# EAGLE schematic MySens-easyRS485-BluePill-MAPLE-V05-not-ordered-018 (EAGLE 7.6.0)
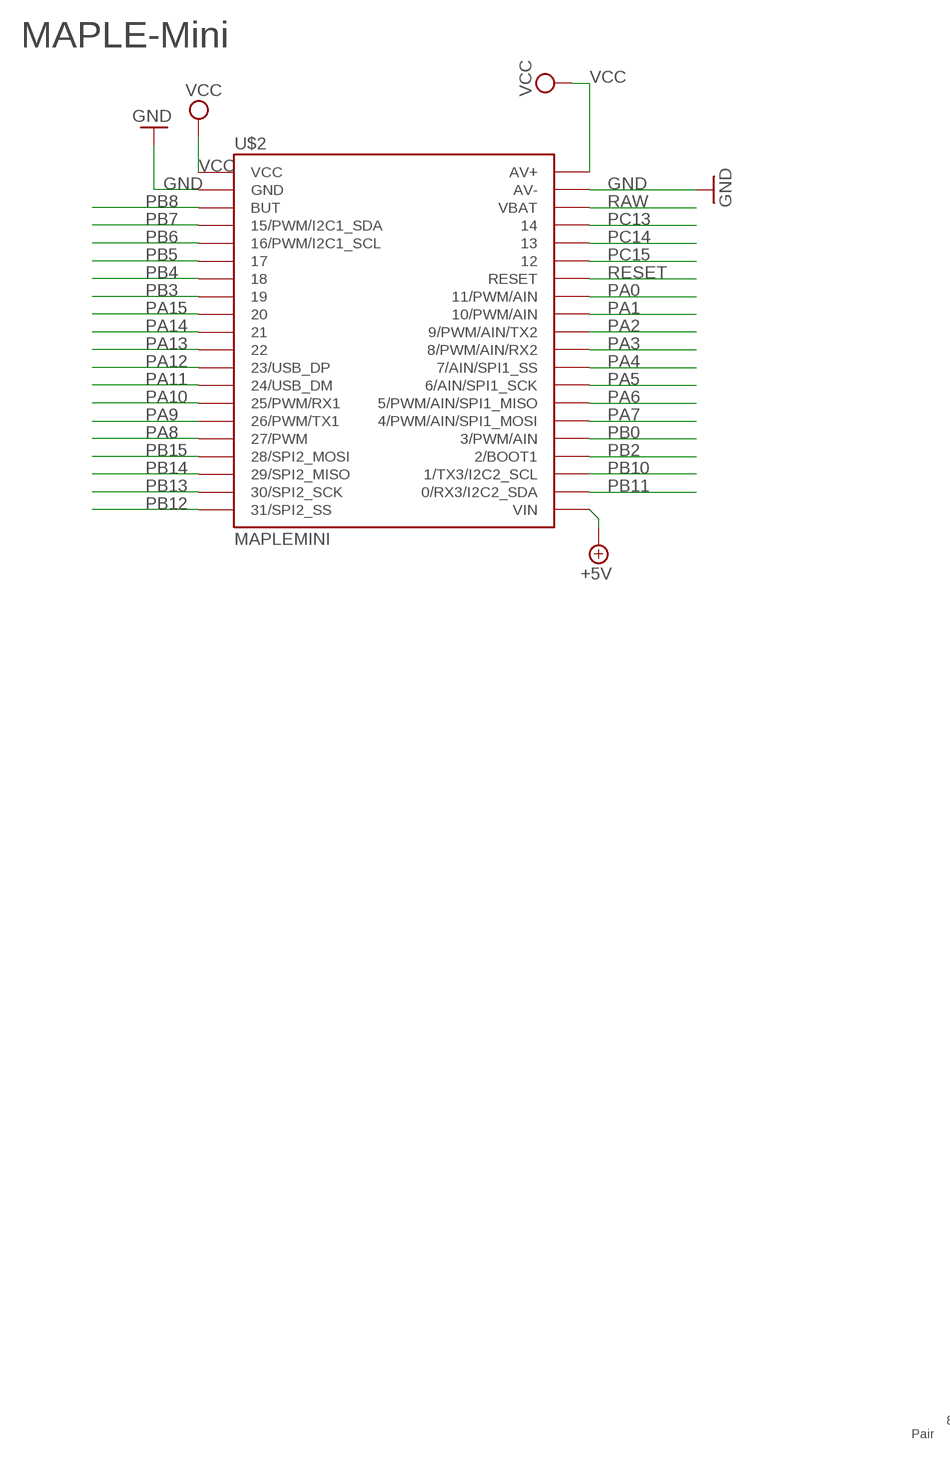
[diagram p0: schematic, sheet 1, part 1 of 2]
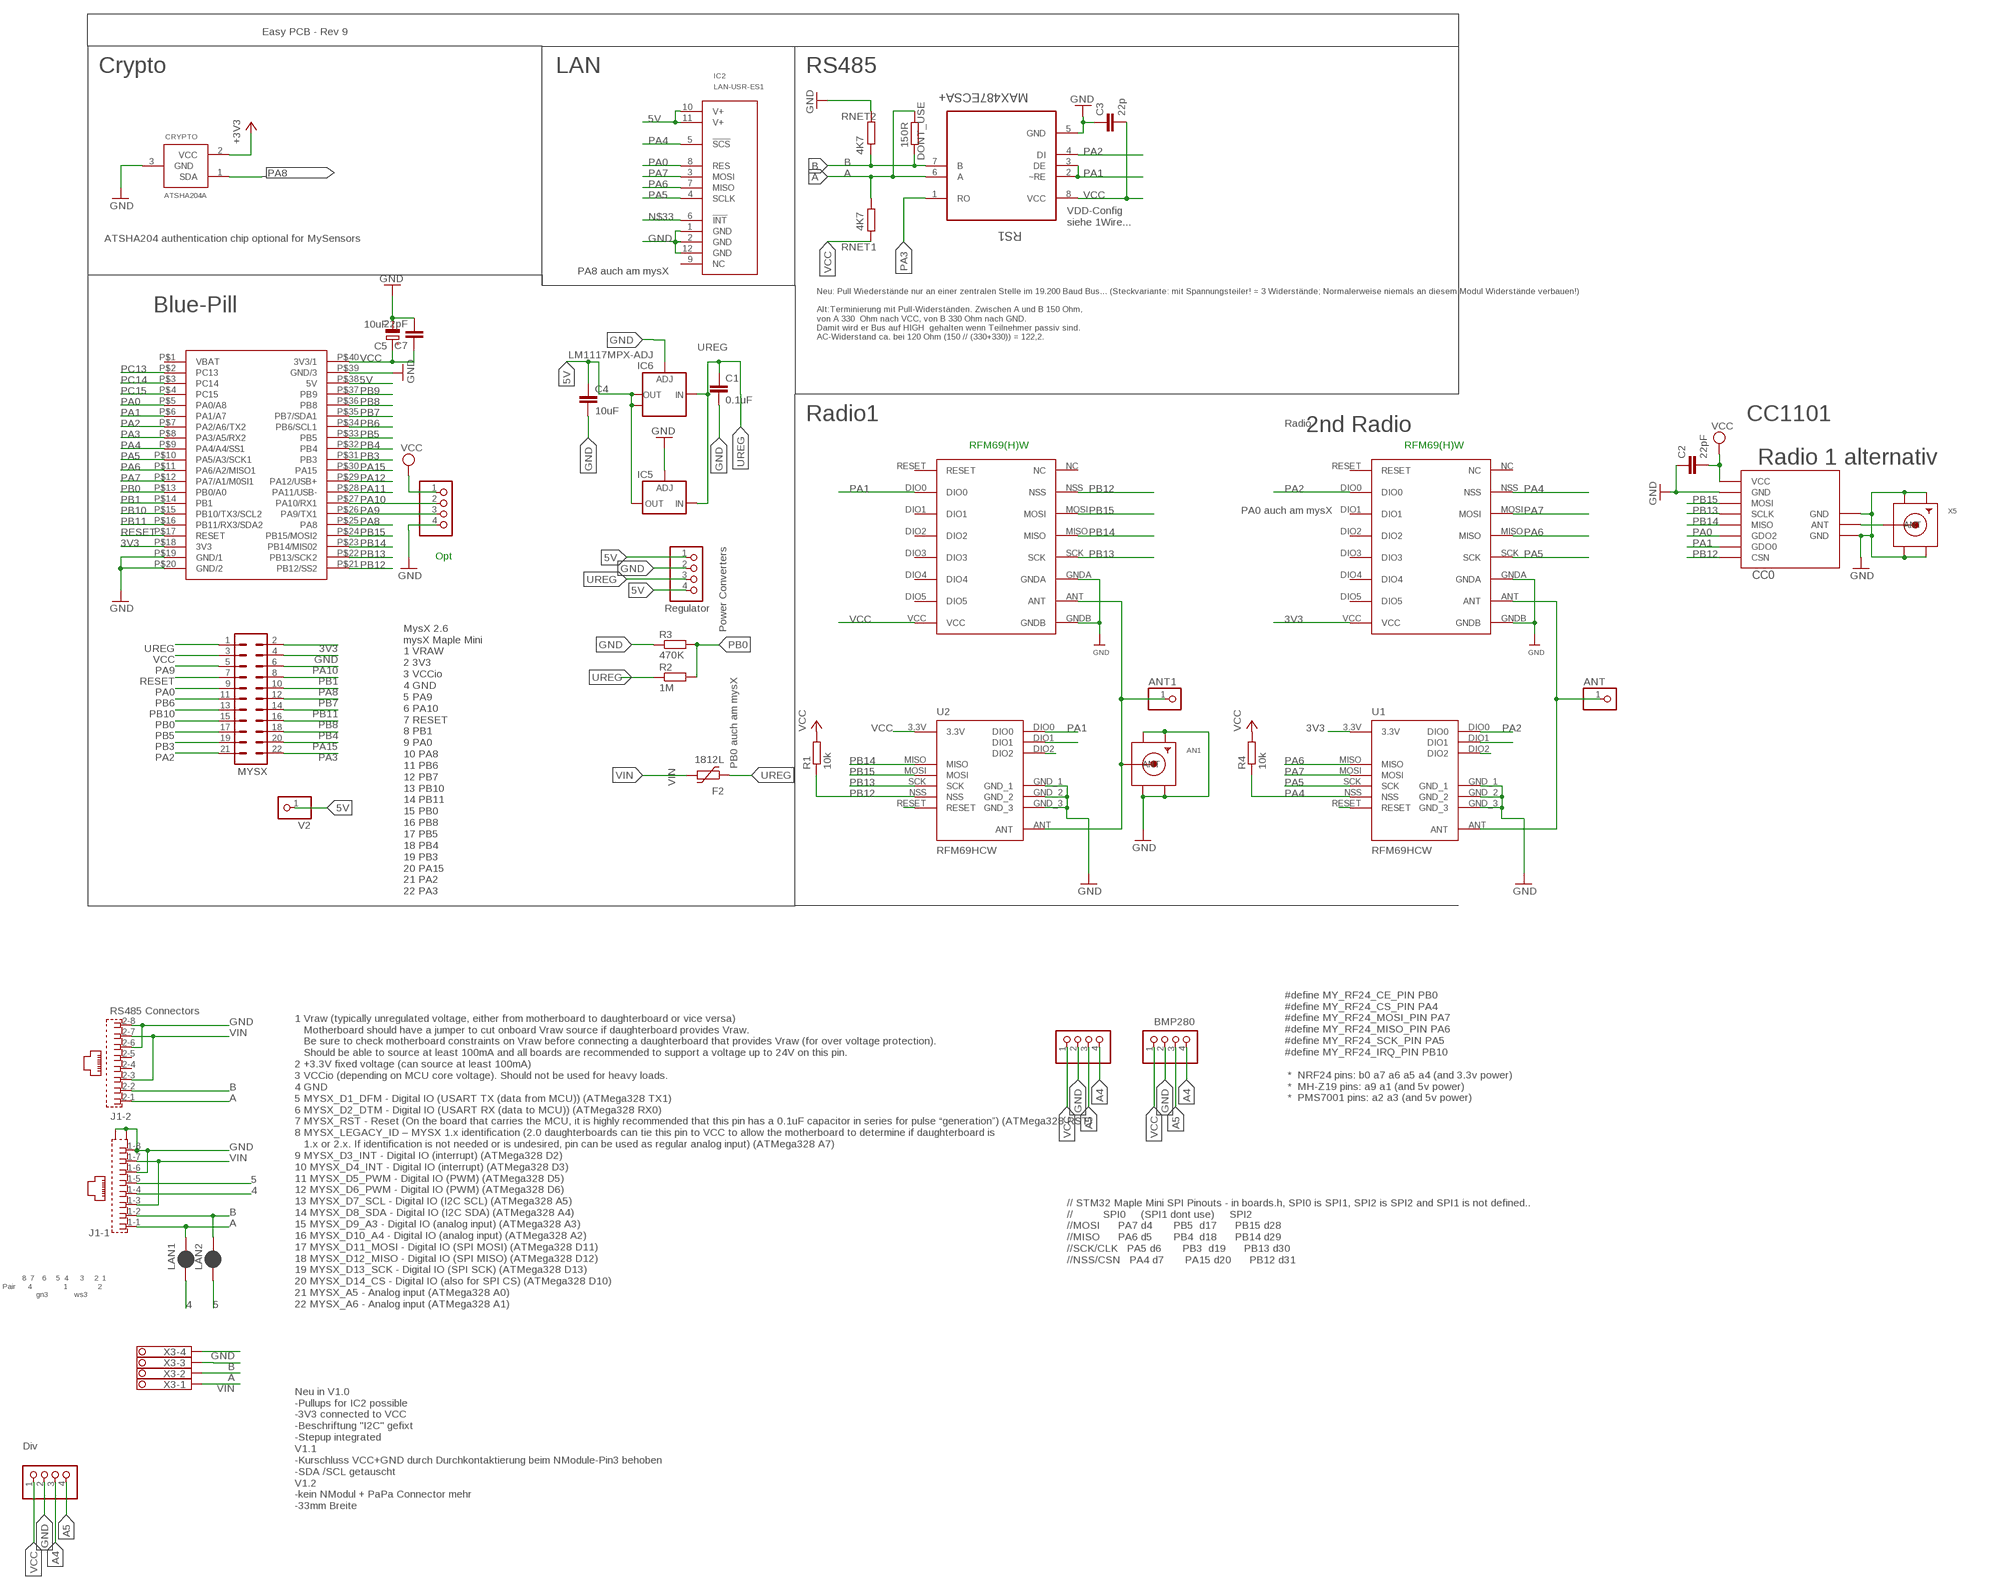
[diagram p1: schematic, sheet 1, part 2 of 2]

## Parts
AN1  SMACONNECTOR_EDGE  [SMA_EDGELAUNCH]
ANT  PINHD-1X1  [1X01]
ANT1  PINHD-1X1  [1X01]
BH1750  PINHD-1X04_2.54-S  [1X04-S]
C1  0.1uF  C-EUC1206  [C1206]
C2  22pF  C-EUC0805  [C0805]
C3  22p  C-EUC0805  [C0805]
C4  10uF  C-EUC1210  [C1210]
C5  10uF  CPOL-EUR/2012-12W  [R/2012-12W]
C7  22pF  C-EUC0805  [C0805]
CC0  CC1101  CC1101_MODULE1SMD  [CC1101_MODULE1_SMD]
CRYPTO  ATSHA204A  [SOT23]
DBG  PINHD-1X04_2.54-S  [1X04-S]
DONT_USE  150R  R-EU_R0805  [R0805]
F2  1812L  [1812L]
I2C-1  PINHD-1X04_2.54-S  [1X04-S]
I2C-2  PINHD-1X04_2.54-S  [1X04-S]
IC2  LAN-USR-ES1  [USR-ES1]
IC5  LD117ADT50TR  [DPACK]
IC6  LM1117MPX-ADJ  [SOT223]
J1  RJ45_2X_NARROW_SHILDPINS_NOCASE  [RJ45_2X_NARROW_SHILDPINS_NOCASE]
LAN1  JUMPER-SMT_2_NC_PASTE_SILK  [SMT-JUMPER_2_NC_PASTE_SILK]
LAN2  JUMPER-SMT_2_NC_PASTE_SILK  [SMT-JUMPER_2_NC_PASTE_SILK]
MYSX  MA11-2  [MA11-2]
R1  10k  R-EU_M0805  [M0805]
R2  1M  R-EU_R0805  [R0805]
R3  470K  R-EU_R0805  [R0805]
R4  10k  R-EU_M0805  [M0805]
RFM69W  RFM69HW  [RFM]
RFM69W1  RFM69HW  [RFM]
RNET1  4K7  R-EU_R0805  [R0805]
RNET2  4K7  R-EU_R0805  [R0805]
RS1  MAX487ECSA+  [SOIC127P600X175-8N]
STEPDWN  PINHD-1X04_2.54-S  [1X04-S]
U1  RFM69HCW  [RFM69HCW-XXXS2]
U2  RFM69HCW  [RFM69HCW-XXXS2]
U$2  MAPLEMINI  [20-DIP]
U$4  BLUEPILL  [BLUEPILL]
V2  PINHD-1X1  [1X01]
X3  1751264  [1751264]
X5  SMACONNECTOR_EDGE  [SMA_EDGELAUNCH]

## Nets
3V3: CRYPTO.2(VCC) MYSX.2 RFM69W.VCC U1.3.3V U$4.P$18(3V3) ; supply symbol labelled +3V3
4: J1.1-4 LAN1.1
5: J1.1-5 LAN2.1
5V: C4.1 IC2.10(V+) IC2.11(V+) IC5.4(OUT) IC6.2(OUT) IC6.TAB(OUT1) STEPDWN.1 STEPDWN.4 U$4.P$38(5V) V2.1
+5V [PWR]: U$2.21(VIN)
A: DONT_USE.1 J1.1-1 J1.2-1 LAN1.2 RNET1.2 RS1.6(A) X3.2
A4: BH1750.4 I2C-1.4 I2C-2.3
A5: BH1750.3 I2C-1.3 I2C-2.4
ANT0: CC0.ANT X5.P(ANT)
ANT1: AN1.P(ANT) ANT1.1 RFM69W1.ANT U2.ANT
ANT2: ANT.1 RFM69W.ANT U1.ANT
B: DONT_USE.2 J1.1-2 J1.2-2 LAN2.2 RNET2.1 RS1.7(B) X3.3
GND [PWR]: AN1.GND@1(GND4) AN1.GND@2(GND3) AN1.GND@3(GND2) AN1.GND@4(GND1) BH1750.2 C1.2 C2.1 C3.1 C4.2 C5.- C7.2 CC0.GND@0(GND) CC0.GND@1(GND) CC0.GND@2(GND) CRYPTO.3(GND) DBG.4 I2C-1.2 I2C-2.2 IC2.1(GND) IC2.2(GND) IC2.12(GND) IC5.1(ADJ) IC6.1(ADJ) J1.1-6 J1.1-8 J1.2-6 J1.2-8 J1.G1(-1:S1) J1.G3(-1:S2) MYSX.4 R3.1 RFM69W1.GNDA RFM69W1.GNDB RFM69W.GNDA RFM69W.GNDB RNET2.2 RS1.5(GND) STEPDWN.2 U1.GND_1 U1.GND_2 U1.GND_3 U2.GND_1 U2.GND_2 U2.GND_3 U$2.2(GND) U$2.39(AV-) U$4.P$19(GND/1) U$4.P$20(GND/2) U$4.P$39(GND/3) X3.4 X5.GND@1(GND4) X5.GND@2(GND3) X5.GND@3(GND2) X5.GND@4(GND1)
N$1: U1.RESET
N$4: U2.DIO2
N$8: U2.DIO1
N$9: U2.RESET
N$14: U1.DIO2
N$15: U1.DIO1
N$33: IC2.6(!INT!)
PA0: CC0.GDO2 IC2.8(RES) MYSX.9 U$2.33(11/PWM/AIN) U$4.P$5(PA0/A8)
PA1: CC0.GDO0 RFM69W1.DIO0 RS1.2(~RE) RS1.3(DE) U2.DIO0 U$2.32(10/PWM/AIN) U$4.P$6(PA1/A7)
PA2: MYSX.21 RFM69W.DIO0 RS1.4(DI) U1.DIO0 U$2.31(9/PWM/AIN/TX2) U$4.P$7(PA2/A6/TX2)
PA3: MYSX.22 RS1.1(RO) U$2.30(8/PWM/AIN/RX2) U$4.P$8(PA3/A5/RX2)
PA4: IC2.5(!SCS!) R4.1 RFM69W.NSS U1.NSS U$2.29(7/AIN/SPI1_SS) U$4.P$9(PA4/A4/SS1)
PA5: IC2.4(SCLK) RFM69W.SCK U1.SCK U$2.28(6/AIN/SPI1_SCK) U$4.P$10(PA5/A3/SCK1)
PA6: IC2.7(MISO) RFM69W.MISO U1.MISO U$2.27(5/PWM/AIN/SPI1_MISO) U$4.P$11(PA6/A2/MISO1)
PA7: IC2.3(MOSI) RFM69W.MOSI U1.MOSI U$2.26(4/PWM/AIN/SPI1_MOSI) U$4.P$12(PA7/A1/M0SI1)
PA8: CRYPTO.1(SDA) MYSX.10 U$2.16(27/PWM) U$4.P$25(PA8)
PA9: DBG.3 MYSX.5 U$2.15(26/PWM/TX1) U$4.P$26(PA9/TX1)
PA10: DBG.2 MYSX.6 U$2.14(25/PWM/RX1) U$4.P$27(PA10/RX1)
PA11: U$2.13(24/USB_DM) U$4.P$28(PA11/USB-)
PA12: U$2.12(23/USB_DP) U$4.P$29(PA12/USB+)
PA13: U$2.11
PA14: U$2.10
PA15: MYSX.20 U$2.9 U$4.P$30(PA15)
PB0: MYSX.15 R2.2 R3.2 U$2.25(3/PWM/AIN) U$4.P$13(PB0/A0)
PB1: MYSX.8 U$4.P$14(PB1)
PB2 [PWR]: U$2.24(2/BOOT1)
PB3: MYSX.19 U$2.8 U$4.P$31(PB3)
PB4: MYSX.18 U$2.7 U$4.P$32(PB4)
PB5: MYSX.17 U$2.6 U$4.P$33(PB5)
PB6: MYSX.11 U$2.5(16/PWM/I2C1_SCL) U$4.P$34(PB6/SCL1)
PB7: MYSX.12 U$2.4(15/PWM/I2C1_SDA) U$4.P$35(PB7/SDA1)
PB8: MYSX.16 U$2.3(BUT) U$4.P$36(PB8)
PB9: U$4.P$37(PB9)
PB10: MYSX.13 U$2.23(1/TX3/I2C2_SCL) U$4.P$15(PB10/TX3/SCL2)
PB11: MYSX.14 U$2.22(0/RX3/I2C2_SDA) U$4.P$16(PB11/RX3/SDA2)
PB12: CC0.CSN R1.1 RFM69W1.NSS U2.NSS U$2.20(31/SPI2_SS) U$4.P$21(PB12/SS2)
PB13: CC0.SCLK RFM69W1.SCK U2.SCK U$2.19(30/SPI2_SCK) U$4.P$22(PB13/SCK2)
PB14: CC0.MISO RFM69W1.MISO U2.MISO U$2.18(29/SPI2_MISO) U$4.P$23(PB14/MIS02)
PB15: CC0.MOSI RFM69W1.MOSI U2.MOSI U$2.17(28/SPI2_MOSI) U$4.P$24(PB15/MOSI2)
PC13: U$2.37 U$4.P$2(PC13)
PC14: U$2.36 U$4.P$3(PC14)
PC15: U$2.35 U$4.P$4(PC15)
RAW: U$2.38(VBAT)
RESET: MYSX.7 U$2.34(RESET) U$4.P$17(RESET)
UREG [PWR]: C1.1 F2.P$1 IC5.3(IN) IC6.3(IN) MYSX.1 R2.1 STEPDWN.3
VCC [PWR]: BH1750.1 C2.2 C3.2 C5.+ C7.1 CC0.VCC DBG.1 I2C-1.1 I2C-2.1 MYSX.3 R1.2 R4.2 RFM69W1.VCC RNET1.1 RS1.8(VCC) U2.3.3V U$2.1(VCC) U$2.40(AV+) U$4.P$40(3V3/1)
VIN [PWR]: F2.P$2 J1.1-3 J1.1-7 J1.2-3 J1.2-7 X3.1
Unconnected: IC2.9(NC) J1.2-4 J1.2-5 RFM69W1.DIO1 RFM69W1.DIO2 RFM69W1.DIO3 RFM69W1.DIO4 RFM69W1.DIO5 RFM69W1.NC RFM69W1.RESET RFM69W.DIO1 RFM69W.DIO2 RFM69W.DIO3 RFM69W.DIO4 RFM69W.DIO5 RFM69W.NC RFM69W.RESET U$4.P$1(VBAT)

## Notes on the sheet
- Easy PCB - Rev 9
- Crypto | LAN | RS485
- VDD-Config
  siehe 1Wire...
- ATSHA204 authentication chip optional for MySensors
- PA8 auch am mysX
- Blue-Pill
- Neu: Pull Wiederstände nur an einer zentralen Stelle im 19.200 Baud Bus... (Steckvariante: mit Spannungsteiler! = 3 Widerstände; Normalerweise niemals an diesem Modul Widerstände verbauen!)
  
  Alt:Terminierung mit Pull-Widerständen. Zwischen A und B 150 Ohm,
  von A 330  Ohm nach VCC, von B 330 Ohm nach GND. 
  Damit wird er Bus auf HIGH  gehalten wenn Teilnehmer passiv sind.
  AC-Widerstand ca. bei 120 Ohm (150 // (330+330)) = 122,2.
- Radio1 | CC1101
- Radio
- MAPLE-Mini | 2nd Radio
- RFM69(H)W | RFM69(H)W
- Radio 1 alternativ
- PA0 auch am mysX
- Power Converters
- Opt
- Regulator
- PB0 auch am mysX
- MysX 2.6
  mysX Maple Mini
  1 VRAW
  2 3V3
  3 VCCio
  4 GND
  5 PA9
  6 PA10
  7 RESET
  8 PB1
  9 PA0
  10 PA8
  11 PB6
  12 PB7
  13 PB10
  14 PB11
  15 PB0
  16 PB8
  17 PB5
  18 PB4
  19 PB3
  20 PA15
  21 PA2
  22 PA3
- RS485 Connectors
- BMP280
- #define MY_RF24_CE_PIN PB0 
  #define MY_RF24_CS_PIN PA4 
  #define MY_RF24_MOSI_PIN PA7 
  #define MY_RF24_MISO_PIN PA6 
  #define MY_RF24_SCK_PIN PA5 
  #define MY_RF24_IRQ_PIN PB10
  
   *  NRF24 pins: b0 a7 a6 a5 a4 (and 3.3v power)
   *  MH-Z19 pins: a9 a1 (and 5v power)
   *  PMS7001 pins: a2 a3 (and 5v power)
- // STM32 Maple Mini SPI Pinouts - in boards.h, SPI0 is SPI1, SPI2 is SPI2 and SPI1 is not defined..
  //          SPI0     (SPI1 dont use)     SPI2
  //MOSI      PA7 d4       PB5  d17      PB15 d28
  //MISO      PA6 d5       PB4  d18      PB14 d29
  //SCK/CLK   PA5 d6       PB3  d19      PB13 d30
  //NSS/CSN   PA4 d7       PA15 d20      PB12 d31
- 8  7    6     5  4      3     2  1
  Pair      4                1               2
                   gn3             ws3
- 1 Vraw (typically unregulated voltage, either from motherboard to daughterboard or vice versa)
     Motherboard should have a jumper to cut onboard Vraw source if daughterboard provides Vraw. 
     Be sure to check motherboard constraints on Vraw before connecting a daughterboard that provides Vraw (for over voltage protection). 
     Should be able to source at least 100mA and all boards are recommended to support a voltage up to 24V on this pin.
  2 +3.3V fixed voltage (can source at least 100mA)
  3 VCCio (depending on MCU core voltage). Should not be used for heavy loads.
  4 GND
  5 MYSX_D1_DFM - Digital IO (USART TX (data from MCU)) (ATMega328 TX1)
  6 MYSX_D2_DTM - Digital IO (USART RX (data to MCU)) (ATMega328 RX0)
  7 MYSX_RST - Reset (On the board that carries the MCU, it is highly recommended that this pin has a 0.1uF capacitor in series for pulse “generation”) (ATMega328 RST)
  8 MYSX_LEGACY_ID – MYSX 1.x identification (2.0 daughterboards can tie this pin to VCC to allow the motherboard to determine if daughterboard is 
     1.x or 2.x. If identification is not needed or is undesired, pin can be used as regular analog input) (ATMega328 A7)
  9 MYSX_D3_INT - Digital IO (interrupt) (ATMega328 D2)
  10 MYSX_D4_INT - Digital IO (interrupt) (ATMega328 D3)
  11 MYSX_D5_PWM - Digital IO (PWM) (ATMega328 D5)
  12 MYSX_D6_PWM - Digital IO (PWM) (ATMega328 D6)
  13 MYSX_D7_SCL - Digital IO (I2C SCL) (ATMega328 A5)
  14 MYSX_D8_SDA - Digital IO (I2C SDA) (ATMega328 A4)
  15 MYSX_D9_A3 - Digital IO (analog input) (ATMega328 A3)
  16 MYSX_D10_A4 - Digital IO (analog input) (ATMega328 A2)
  17 MYSX_D11_MOSI - Digital IO (SPI MOSI) (ATMega328 D11)
  18 MYSX_D12_MISO - Digital IO (SPI MISO) (ATMega328 D12)
  19 MYSX_D13_SCK - Digital IO (SPI SCK) (ATMega328 D13)
  20 MYSX_D14_CS - Digital IO (also for SPI CS) (ATMega328 D10)
  21 MYSX_A5 - Analog input (ATMega328 A0)
  22 MYSX_A6 - Analog input (ATMega328 A1)
- Div
- Neu in V1.0
  -Pullups for IC2 possible
  -3V3 connected to VCC
  -Beschriftung "I2C" gefixt
  -Stepup integrated
  V1.1
  -Kurschluss VCC+GND durch Durchkontaktierung beim NModule-Pin3 behoben
  -SDA /SCL getauscht
  V1.2
  -kein NModul + PaPa Connector mehr
  -33mm Breite

## Library data of the parts
AN1 X5 = adafruit:SMACONNECTOR: SMA Connector 90° DIP SMA Connector, 50 Ohm (4UConnector: 07259)
ANT ANT1 V2 = pinhead:PINHD-1X1: PIN HEADER
BH1750 DBG I2C-1 I2C-2 STEPDWN = pinhead-2:PINHD-1X04: PIN HEADER
C1-C4 C7 = rcl:C-EU: CAPACITOR, European symbol
C5 = rcl:CPOL-EU: POLARIZED CAPACITOR, European symbol
CC0 = wireless:CC1101_MODULE1: CC1101 wireless module for 433/868 MHz (sold from Aliexpress). DIL version for mounting with pin header (and SMD soldering) and SMD only variant available.
CRYPTO = Sensor:ATSHA204A
DONT_USE R1-R4 RNET1 RNET2 = rcl:R-EU_: RESISTOR, European symbol
F2 = ptc-littlefuse:1812L
IC2 = Martin-Communication:LAN-USR-ES1
IC5 = v-reg:LD117A?*: Low drop fixed and adjustable positive voltage regulators 1 A Source: http://www.st.com/stonline/products/literature/ds/7194/ld1117axx.pdf
IC6 = lm1117:LM1117MPX-ADJ
J1 = RJ45:RJ45_2X_NARROW_SHILDPINS_NOCASE: RJ45 connector
LAN1 LAN2 = SparkFun-Jumpers:JUMPER-SMT_2_NC_PASTE: Normally closed solder jumper This jumper has an aperture in the stencil to allow solder paste to bridge the split in the wire so it's normally closed (NC). Wick off the solder to open the connection. Reapply solder to reclose the connection.
MYSX = con-Pinheader:MA11-2: PIN HEADER; OC_FARNELL: unknown; OC_NEWARK: unknown
RFM69W RFM69W1 = hoperf:RFM69HW
RS1 = Maxim_By_element14_Batch_1:MAX487ECSA+: Low-Power, Slew-Rate-Limited RS-485/RS-422 Transceivers; MPN: MAX487ECSA+; OC_FARNELL: 9724532; OC_NEWARK: 68K4803; PACKAGE: SOIC-8; SUPPLIER: Maxim
U1 U2 = doug:RFM69H
U$2 = maplemini-small:MAPLEMINI
U$4 = stm32duino boards:BLUEPILL
X3 = con-phoenix-350:1751264: MKDS 1/ 4-3,5 Printklemme Nennstrom: 10 A Bemessungsspannung: 160 V Raster: 3,5 mm Polzahl: 4 Montageart: Löten Anschlussart: Schraubanschluss Anschlussrichtung vom Leiter zur Platine: 0° Source: http://eshop.phoenixcontact.com .. 1751264.pdf; MPN: 1751264; OC_FARNELL: unknown; OC_NEWARK: 10R0934

## Net classes
0 default: width 0.254 mm, clearance 0.205 mm
1 PWR: width 0.406 mm, clearance 0.205 mm to class 0, clearance 0.205 mm